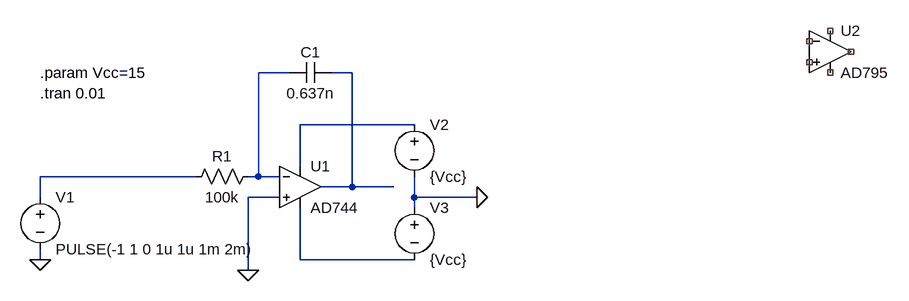
[diagram p0: schematic Draft10.asc]
Draft10.asc, the LTspice schematic file:
Version 4.1
SHEET 1 1136 680
WIRE 208 -16 160 -16
WIRE 304 -16 272 -16
WIRE 400 64 224 64
WIRE 224 128 224 64
WIRE 64 144 -176 144
WIRE 160 144 160 -16
WIRE 160 144 144 144
WIRE 192 144 160 144
WIRE 304 160 304 -16
WIRE 304 160 256 160
WIRE 368 160 304 160
WIRE -176 176 -176 144
WIRE 192 176 144 176
WIRE 400 176 400 144
WIRE 496 176 400 176
WIRE 400 192 400 176
WIRE -176 272 -176 256
WIRE 224 272 224 192
WIRE 400 272 224 272
WIRE 144 288 144 176
FLAG -176 272 0
FLAG 144 288 0
FLAG 496 176 0
SYMBOL voltage -176 160 R0
WINDOW 123 0 0 Left 0
WINDOW 39 0 0 Left 0
SYMATTR InstName V1
SYMATTR Value PULSE(-1 1 0 1u 1u 1m 2m)
SYMBOL res 160 128 R90
WINDOW 0 0 56 VBottom 2
WINDOW 3 32 56 VTop 2
SYMATTR InstName R1
SYMATTR Value 100k
SYMBOL cap 272 -32 R90
WINDOW 0 0 32 VBottom 2
WINDOW 3 32 32 VTop 2
SYMATTR InstName C1
SYMATTR Value 0.637n
SYMBOL voltage 400 48 R0
SYMATTR InstName V2
SYMATTR Value {Vcc}
SYMBOL voltage 400 176 R0
SYMATTR InstName V3
SYMATTR Value {Vcc}
SYMBOL OpAmps\\AD744 224 96 R0
SYMATTR InstName U1
SYMBOL OpAmps\\AD795 1040 -112 R0
SYMATTR InstName U2
TEXT -176 -16 Left 2 !.param Vcc=15
TEXT -176 16 Left 2 !.tran 0.01

The netlist it stands for:
* Draft10.asc
V1 N004 0 PULSE(-1 1 0 1u 1u 1m 2m)
R1 N001 N004 100k
C1 N002 N001 0.637n
V2 N003 0 {Vcc}
V3 0 N005 {Vcc}
X§U1 0 N001 N003 N005 N002 AD744  ; pins In+ In- V+ V- OUT
X§U2 NC_01 NC_02 NC_03 NC_04 NC_05 AD795  ; pins In+ In- V+ V- OUT
.param Vcc=15
.tran 0.01
.lib ADI1.lib
.backanno
.end